# Altium schematic sheet 4Wheel_MotorDrivers_Encoders.SchDoc
size B
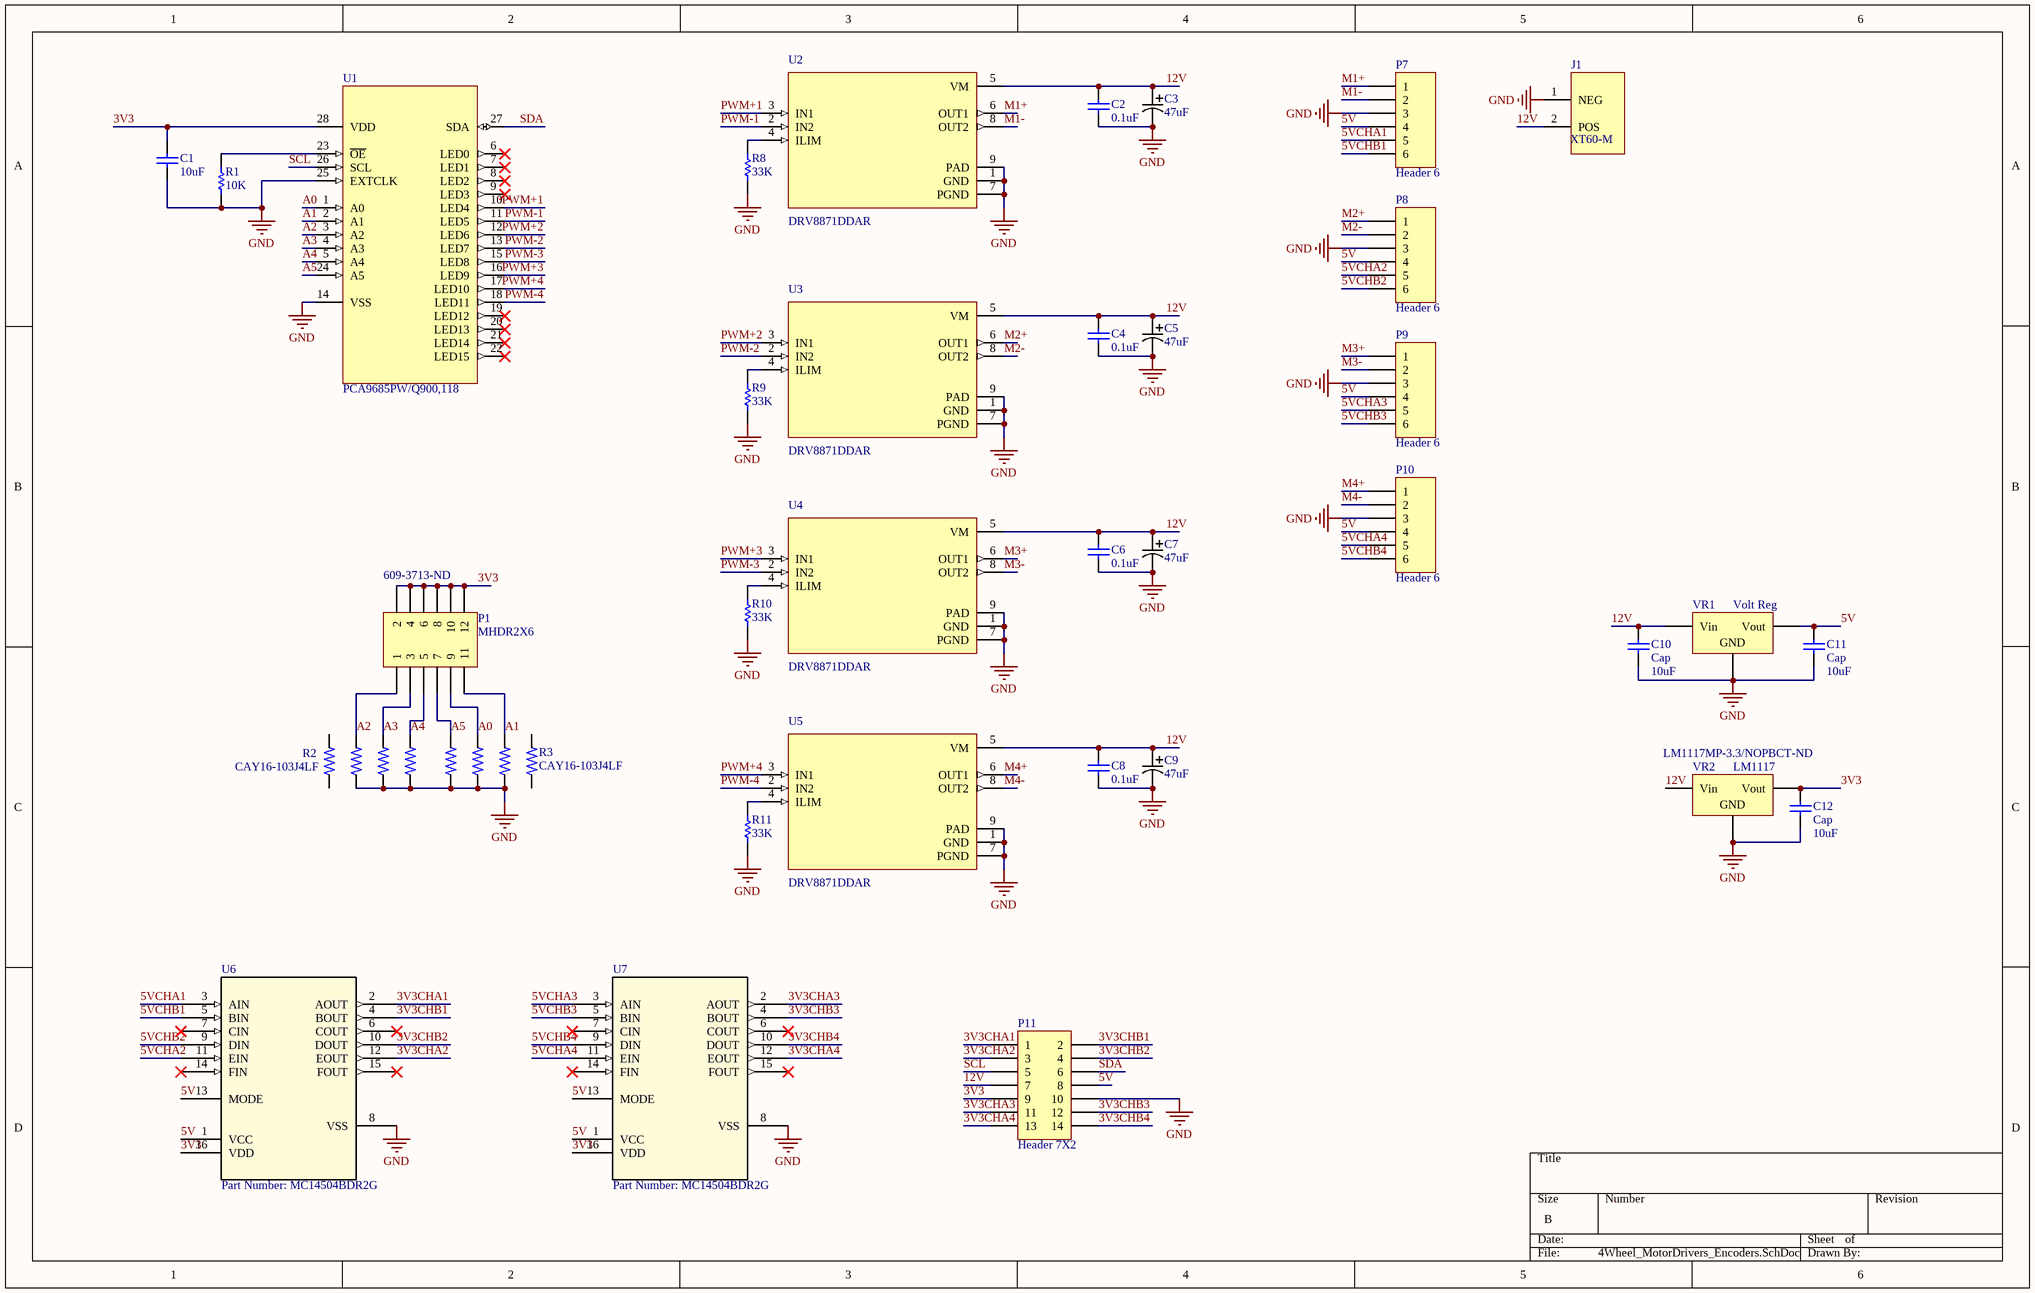
[diagram p0: 4Wheel_MotorDrivers_Encoders.SchDoc]

## Parts
C1  value 10uF  [6-0805_N]  (hidden comment: Cap)
C2  0.1uF  [6-0805_N]
C3  47uF  [PCAP_6.3x7.7-ELE]
C4  0.1uF  [6-0805_N]
C5  47uF  [PCAP_6.3x7.7-ELE]
C6  0.1uF  [6-0805_N]
C7  47uF  [PCAP_6.3x7.7-ELE]
C8  0.1uF  [6-0805_N]
C9  47uF  [PCAP_6.3x7.7-ELE]
C10  Cap  value 10uF  [6-0805_N]
C11  Cap  value 10uF  [6-0805_N]
C12  Cap  value 10uF  [6-0805_N]
J1  XT60-M  [*AMASS_XT60-M]
P1  MHDR2X6  Supplier Part Number 1: 609-3713-ND  [MHDR2X6]
P7  Header 6  [HDR1X6]
P8  Header 6  [HDR1X6]
P9  Header 6  [HDR1X6]
P10  Header 6  [HDR1X6]
P11  Header 7X2  [HDR1X14]
R1  value 10K  [6-0805_N]  (hidden comment: Res1)
R2  CAY16-103J4LF  [CAY16-J4]
R3  CAY16-103J4LF  [CAY16-J4]
R8  value 33K  [6-0805_N]  (hidden comment: Res1)
R9  value 33K  [6-0805_N]  (hidden comment: Res1)
R10  value 33K  [6-0805_N]  (hidden comment: Res1)
R11  value 33K  [6-0805_N]  (hidden comment: Res1)
U1  PCA9685PW/Q900,118  [*SOP65P640X110-28N]
U2  DRV8871DDAR  [*SOIC127P600X170-8N]
U3  DRV8871DDAR  [*SOIC127P600X170-8N]
U4  DRV8871DDAR  [*SOIC127P600X170-8N]
U5  DRV8871DDAR  [*SOIC127P600X170-8N]
U6  Part Number: MC14504BDR2G  [SOIC-16]
U7  Part Number: MC14504BDR2G  [SOIC-16]
VR1  Volt Reg  [*TO254P1524X483-4N]
VR2  LM1117  Supplier Part Number 1: LM1117MP-3.3/NOPBCT-ND  [SOT223_L]

## Nets
GND: C1.1 C2.1 C3.2 C4.1 C5.2 C6.1 C7.2 C8.1 C9.2 C10.1 C11.1 C12.1 J1.1(NEG) P7.3 P8.3 P9.3 P10.3 P11.10 R1.1 R2.2 R2.3 R2.4 R3.1 R3.2 R3.3 R8.1 R9.1 R10.1 R11.1 U1.14(VSS) U1.25(EXTCLK) U2.1(GND) U2.7(PGND) U2.9(PAD) U3.1(GND) U3.7(PGND) U3.9(PAD) U4.1(GND) U4.7(PGND) U4.9(PAD) U5.1(GND) U5.7(PGND) U5.9(PAD) U6.8(VSS) U7.8(VSS) VR1.2(GND) VR2.2(GND)
3V3: C1.2 C12.2 P1.2 P1.4 P1.6 P1.8 P1.10 P1.12 P11.9 U1.28(VDD) U6.16(VDD) U7.16(VDD) VR2.3(Vout)
3V3CHA1: P11.1 U6.2(AOUT)
3V3CHA2: P11.3 U6.12(EOUT)
3V3CHA3: P11.11 U7.2(AOUT)
3V3CHA4: P11.13 U7.12(EOUT)
3V3CHB1: P11.2 U6.4(BOUT)
3V3CHB2: P11.4 U6.10(DOUT)
3V3CHB3: P11.12 U7.4(BOUT)
3V3CHB4: P11.14 U7.10(DOUT)
5V: C11.2 P7.4 P8.4 P9.4 P10.4 P11.8 U6.1(VCC) U6.13(MODE) U7.1(VCC) U7.13(MODE) VR1.3(Vout)
5VCHA1: P7.5 U6.3(AIN)
5VCHA2: P8.5 U6.11(EIN)
5VCHA3: P9.5 U7.3(AIN)
5VCHA4: P10.5 U7.11(EIN)
5VCHB1: P7.6 U6.5(BIN)
5VCHB2: P8.6 U6.9(DIN)
5VCHB3: P9.6 U7.5(BIN)
5VCHB4: P10.6 U7.9(DIN)
12V: C2.2 C3.1 C4.2 C5.1 C6.2 C7.1 C8.2 C9.1 C10.2 J1.2(POS) P11.7 U2.5(VM) U3.5(VM) U4.5(VM) U5.5(VM) VR1.1(Vin) VR2.1(Vin)
A0: P1.9 R3.7 U1.1(A0)
A1: P1.11 R3.6 U1.2(A1)
A2: P1.1 R2.7 U1.3(A2)
A3: P1.3 R2.6 U1.4(A3)
A4: P1.5 R2.5 U1.5(A4)
A5: P1.7 R3.8 U1.24(A5)
M1+: P7.1 U2.6(OUT1)
M1-: P7.2 U2.8(OUT2)
M2+: P8.1 U3.6(OUT1)
M2-: P8.2 U3.8(OUT2)
M3+: P9.1 U4.6(OUT1)
M3-: P9.2 U4.8(OUT2)
M4+: P10.1 U5.6(OUT1)
M4-: P10.2 U5.8(OUT2)
PWM+1: U1.10(LED4) U2.3(IN1)
PWM+2: U1.12(LED6) U3.3(IN1)
PWM+3: U1.16(LED9) U4.3(IN1)
PWM+4: U1.17(LED10) U5.3(IN1)
PWM-1: U1.11(LED5) U2.2(IN2)
PWM-2: U1.13(LED7) U3.2(IN2)
PWM-3: U1.15(LED8) U4.2(IN2)
PWM-4: U1.18(LED11) U5.2(IN2)
SCL: P11.5 U1.26(SCL)
SDA: P11.6 U1.27(SDA)
NetR1_2: R1.2 U1.23(~{OE})
NetR8_2: R8.2 U2.4(ILIM)
NetR9_2: R9.2 U3.4(ILIM)
NetR10_2: R10.2 U4.4(ILIM)
NetR11_2: R11.2 U5.4(ILIM)

Not connected (* = marked no-connect by the designer): R2 1 8; R3 4 5; U1 6(LED0)* 7(LED1)* 8(LED2)* 9(LED3)* 19(LED12)* 20(LED13)* 21(LED14)* 22(LED15)*; U6 6(COUT)* 7(CIN)* 14(FIN)* 15(FOUT)*; U7 6(COUT)* 7(CIN)* 14(FIN)* 15(FOUT)*

## Library data of the parts
C1 C2 C4 C6 C8 C10-C12 = Cap: Capacitor; Published: 8-Jun-2000; LatestRevisionDate: 17-Jul-2002; LatestRevisionNote: Re-released for DXP Platform.; PackageReference: RAD-0.3; Publisher: Altium Limited; PackageDescription: Radial Cap, Thru-Hole; 2 Leads; 0.3 in Pin Spacing
  C1: Supplier 1: Digi-Key; Supplier Part Number 1: 399-4925-1-ND
C3 C5 C7 C9 = UWT1H470MCL1GS: No Description Available; Vendor: Nichicon; Built_By: EMA_UL_Team; Type: DEV; Manufacturer_Part_Number: UWT1H470MCL1GS; Copyright: Copyright (C) 2018 Accelerated Designs. All rights reserved; RefDes: RefDes; Value: Value
  C3: Supplier 1: Digi-Key; Supplier Part Number 1: 493-2225-1-ND
J1 = XT60-M: Plug; DC supply; XT60; male; PIN: 2; for cable; soldered; 30A; 500V; MF: AMASS; Availability: Unavailable; Package: Package Analog Devices; MP: XT60-M; Price: None; SnapEDA_Link: https://www.snapeda.com/parts/XT60-M/AMASS/view-part/2883912/?ref=snap; Value: *
P1 = MHDR2X6: Header, 6-Pin, Dual row; pin to pad: 1>5 5>1 7>11 11>7; LatestRevisionDate: 17-Jul-2002; LatestRevisionNote: Re-released for DXP Platform.; Publisher: Altium Limited; Supplier 1: Digi-Key
P7-P10 = Header 6: Header, 6-Pin; LatestRevisionDate: 17-Jul-2002; LatestRevisionNote: Re-released for DXP Platform.; Publisher: Altium Limited
  P7: Supplier 1: Digi-Key; Supplier Part Number 1: 609-3263-ND
P11 = Header 7X2: Header, 7-Pin, Dual row; LatestRevisionDate: 17-Jul-2002; LatestRevisionNote: Re-released for DXP Platform.; Publisher: Altium Limited
R1 R8-R11 = Res1: Resistor; Published: 8-Jun-2000; LatestRevisionDate: 17-Jul-2002; LatestRevisionNote: Re-released for DXP Platform.; PackageReference: AXIAL-0.3; Publisher: Altium Limited; PackageDescription: Axial Device, Thru-Hole; 2 Leads; 0.3 in Pin Spacing
  R8: Supplier 1: Digi-Key; Supplier Part Number 1: 541-33.0KCCT-ND
R2 R3 = CAY16-103J4LF: 10k Ohm Â±5% 62.5mW Power Per Element Isolated Resistor Network/Array Â±200ppm/Â°C 1206 _3216 Metric_, Convex, Long Side Terminals; MF: Bourns; Package: 1206 Bourns; Availability: Unavailable; MP: CAY16-103J4LF; Value: *; SnapEDA_Link: https://www.snapeda.com/parts/CAY16-103J4LF/Bourns%20-%20J.W.%20Miller/view-part/47136/?ref=snap; Price: None
  R2: Supplier 1: Digi-Key; Supplier Part Number 1: CAY16-103J4LFCT-ND
U1 = PCA9685PW/Q900,118: LED Driver IC 16 Output Linear PWM Dimming 25mA 28-TSSOP; MF: NXP USA; SnapEDA_Link: https://www.snapeda.com/parts/PCA9685PW/Q900%2C118/NXP%20USA%20Inc./view-part/380795/?ref=snap; MP: PCA9685PW/Q900,118; Package: TSSOP-28 NXP Semiconductors; Digi-Key_Part_Number: 568-5931-1-ND; Digi-Key_Purchase_URL: https://www.digikey.com/product-detail/en/nxp-usa-inc/PCA9685PW-Q900,118/568-5931-1-ND/2531218?utm_source=snapeda&utm_medium=aggregator&utm_campaign=symbol; Value: *; Supplier 1: Digi-Key; Supplier Part Number 1: 568-5931-1-ND
U2-U5 = DRV8871DDAR: Unipolar Motor Driver NMOS PWM 8-SO PowerPad; MF: Texas Instruments; Digi-Key_Part_Number: 296-43024-1-ND; Digi-Key_Purchase_URL: https://www.digikey.com/product-detail/en/texas-instruments/DRV8871DDAR/296-43024-1-ND/5722182?utm_source=snapeda&utm_medium=aggregator&utm_campaign=symbol; MP: DRV8871DDAR; Package: SO-8 Texas Instruments; SnapEDA_Link: https://www.snapeda.com/parts/DRV8871DDAR/Texas%20Instruments/view-part/492651/?ref=snap; Value: *; Supplier 1: Digi-Key; Supplier Part Number 1: 296-43024-1-ND
U6 U7 = MC14504BDR2G: No Description Available; Vendor: ON Semiconductor; Copyright: Copyright (C) 2016 Accelerated Designs. All rights reserved; Manufacturer_Part_Number: MC14504BDR2G; RefDes: RefDes; Type: DEV; Value: Value; Supplier 1: Digi-Key; Supplier Part Number 1: MC14504BDGOS-ND
VR1 = Volt Reg: Voltage Regulator; Published: 24-Mar-1999; LatestRevisionDate: 29-May-2009; LatestRevisionNote: IPC-7351 Footprint Added.; PackageReference: D2PAK; Publisher: Altium Limited; PackageDescription: 3-Pin Transistor Outline Package 2.54 mm Pitch, 15.1 mm Lead Span; Supplier 1: Digi-Key; Supplier Part Number 1: 576-1122-ND
VR2 = Volt Reg: Voltage Regulator; pin to pad: 1>3 2>1 3>2; Published: 24-Mar-1999; LatestRevisionDate: 29-May-2009; LatestRevisionNote: IPC-7351 Footprint Added.; PackageReference: D2PAK; Publisher: Altium Limited; PackageDescription: 3-Pin Transistor Outline Package 2.54 mm Pitch, 15.1 mm Lead Span; Supplier 1: Digi-Key